# Altium schematic sheet IMX6ULL_CORE_sch1.SchDoc
size A4
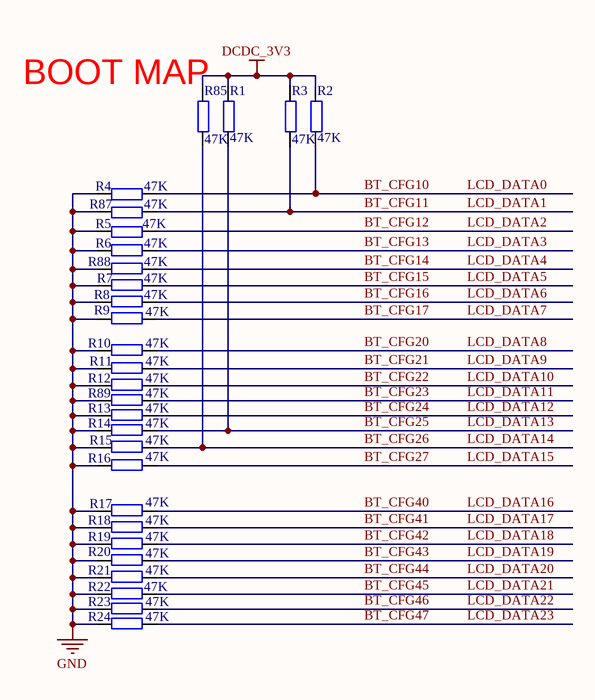
[diagram p0: IMX6ULL_CORE_sch1.SchDoc]

## Parts
R1  47K  [R 0402]
R2  47K  [R 0402]
R3  47K  [R 0402]
R4  47K  [R 0402]
R5  47K  [R 0402]
R6  47K  [R 0402]
R7  47K  [R 0402]
R8  47K  [R 0402]
R9  47K  [R 0402]
R10  47K  [R 0402]
R11  47K  [R 0402]
R12  47K  [R 0402]
R13  47K  [R 0402]
R14  47K  [R 0402]
R15  47K  [R 0402]
R16  47K  [R 0402]
R17  47K  [R 0402]
R18  47K  [R 0402]
R19  47K  [R 0402]
R20  47K  [R 0402]
R21  47K  [R 0402]
R22  47K  [R 0402]
R23  47K  [R 0402]
R24  47K  [R 0402]
R85  47K  [R 0402]
R87  47K  [R 0402]
R88  47K  [R 0402]
R89  47K  [R 0402]

## Nets
DCDC_3V3: R1.2 R2.2 R3.2 R85.2
GND: R4.1 R5.1 R6.2 R7.2 R8.2 R9.2 R10.2 R11.2 R12.2 R13.2 R14.2 R15.2 R16.2 R17.2 R18.2 R19.2 R20.2 R21.2 R22.2 R23.2 R24.2 R87.1 R88.2 R89.2
BT_CFG10: R2.1 R4.2  [also labelled LCD_DATA0]
BT_CFG11: R3.1 R87.2  [also labelled LCD_DATA1]
BT_CFG12: R5.2  [also labelled LCD_DATA2]
BT_CFG13: R6.1  [also labelled LCD_DATA3]
BT_CFG14: R88.1  [also labelled LCD_DATA4]
BT_CFG15: R7.1  [also labelled LCD_DATA5]
BT_CFG16: R8.1  [also labelled LCD_DATA6]
BT_CFG17: R9.1  [also labelled LCD_DATA7]
BT_CFG20: R10.1  [also labelled LCD_DATA8]
BT_CFG21: R11.1  [also labelled LCD_DATA9]
BT_CFG22: R12.1  [also labelled LCD_DATA10]
BT_CFG23: R89.1  [also labelled LCD_DATA11]
BT_CFG24: R13.1  [also labelled LCD_DATA12]
BT_CFG25: R1.1 R14.1  [also labelled LCD_DATA13]
BT_CFG26: R15.1 R85.1  [also labelled LCD_DATA14]
BT_CFG27: R16.1  [also labelled LCD_DATA15]
BT_CFG40: R17.1  [also labelled LCD_DATA16]
BT_CFG41: R18.1  [also labelled LCD_DATA17]
BT_CFG42: R19.1  [also labelled LCD_DATA18]
BT_CFG43: R20.1  [also labelled LCD_DATA19]
BT_CFG44: R21.1  [also labelled LCD_DATA20]
BT_CFG45: R22.1  [also labelled LCD_DATA21]
BT_CFG46: R23.1  [also labelled LCD_DATA22]
BT_CFG47: R24.1  [also labelled LCD_DATA23]

## Notes on the sheet
- (near R85) BOOT MAP

## Library data of the parts
R1-R24 R85 R87-R89 = R